# Altium project UltraZohm_Analog_ADS5272.PrjPcb (part 2 of 2)

## Sheet Opamps.SchDoc
size A4; Author: Thomas Kreppel; CompanyName: Universidad de Santiago de Chile; Address1: Avenida Ecuador Nº 3519; Address2: Estación Central, Santiago; Address3: Chile; DocumentNumber: 5; Revision: 3v01; SheetNumber: 5; SheetTotal: 10
Used 2 times, as channels OpAmps, OpAmps. Parts and nets are listed once, with the designators drawn on the sheet.
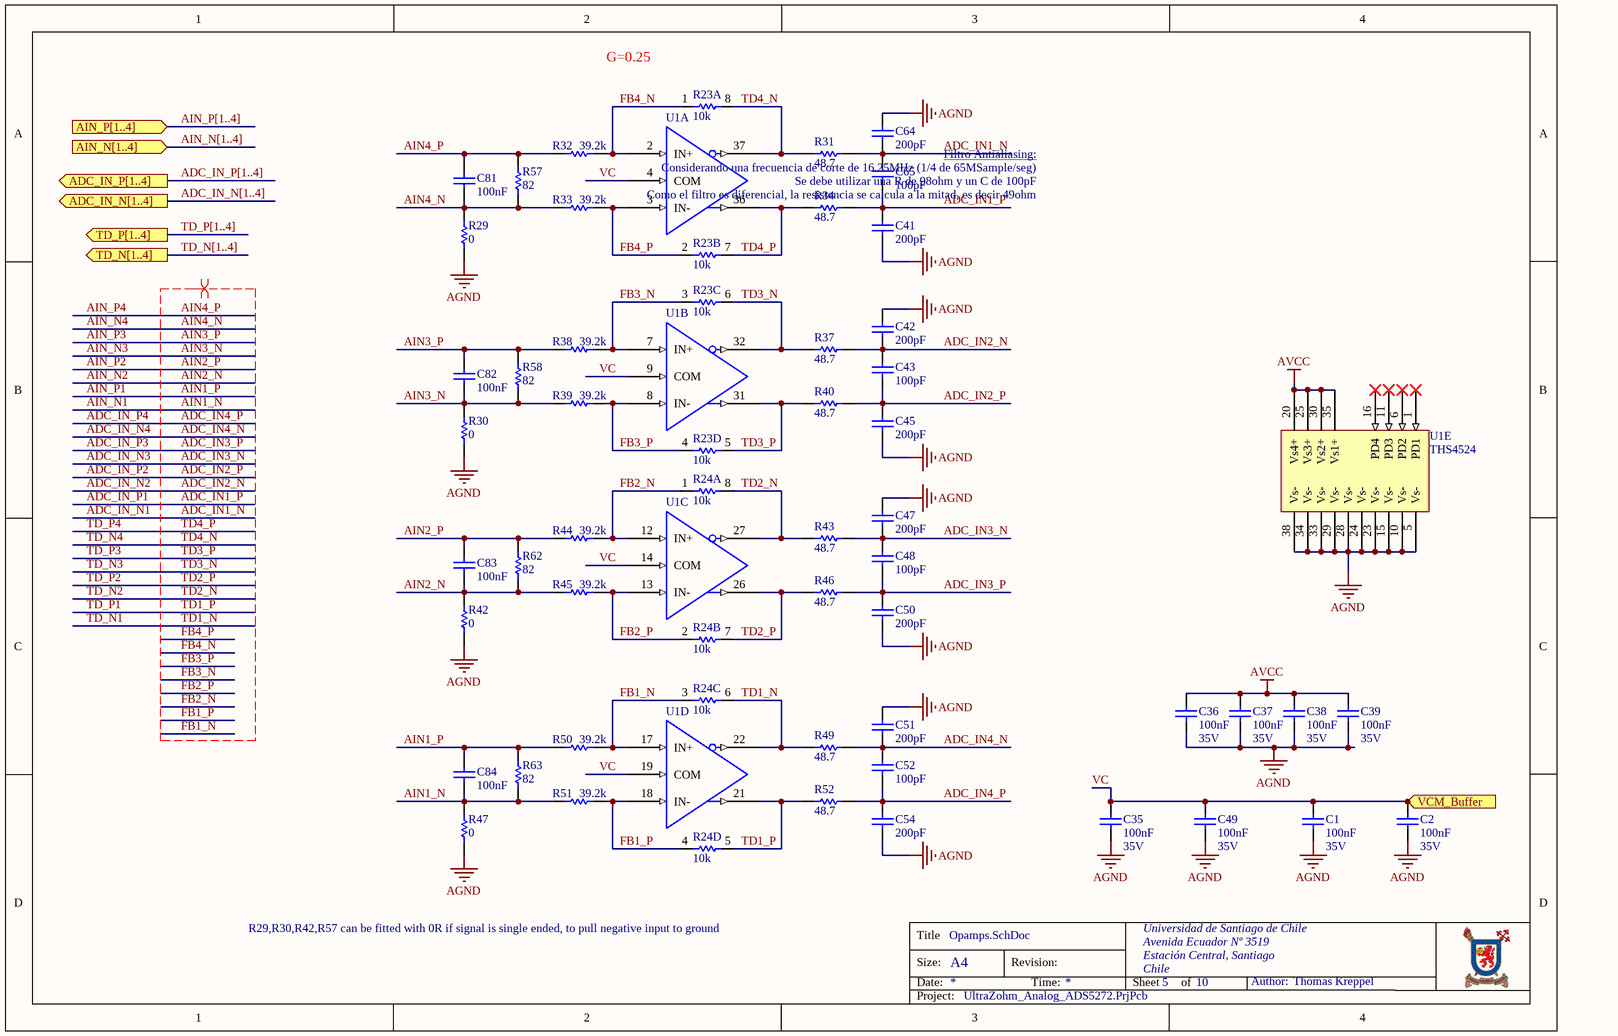
[diagram p9: Opamps.SchDoc]

### Parts
C1  100nF  Voltage: 35V  [CAP_0603]
C2  100nF  Voltage: 35V  [CAP_0603]
C35  100nF  Voltage: 35V  [CAP_0603]
C36  100nF  Voltage: 35V  [CAP_0603]
C37  100nF  Voltage: 35V  [CAP_0603]
C38  100nF  Voltage: 35V  [CAP_0603]
C39  100nF  Voltage: 35V  [CAP_0603]
C41  200pF  [CAP_0603]
C42  200pF  [CAP_0603]
C43  100pF  [CAP_0603]
C45  200pF  [CAP_0603]
C47  200pF  [CAP_0603]
C48  100pF  [CAP_0603]
C49  100nF  Voltage: 35V  [CAP_0603]
C50  200pF  [CAP_0603]
C51  200pF  [CAP_0603]
C52  100pF  [CAP_0603]
C54  200pF  [CAP_0603]
C64  200pF  [CAP_0603]
C65  100pF  [CAP_0603]
C81  100nF  [RES_1206]
C82  100nF  [RES_1206]
C83  100nF  [RES_1206]
C84  100nF  [RES_1206]
R23  10k  [CAC-80P320X160-8N]  (parts A,B,C,D of 4)
R24  10k  [CAC-80P320X160-8N]  (parts A,B,C,D of 4)
R29  0  [RES_0603]
R30  0  [RES_0603]
R31  48.7  [RES_0603]
R32  39.2k  [RES_0603]
R33  39.2k  [RES_0603]
R34  48.7  [RES_0603]
R37  48.7  [RES_0603]
R38  39.2k  [RES_0603]
R39  39.2k  [RES_0603]
R40  48.7  [RES_0603]
R42  0  [RES_0603]
R43  48.7  [RES_0603]
R44  39.2k  [RES_0603]
R45  39.2k  [RES_0603]
R46  48.7  [RES_0603]
R47  0  [RES_0603]
R49  48.7  [RES_0603]
R50  39.2k  [RES_0603]
R51  39.2k  [RES_0603]
R52  48.7  [RES_0603]
R57  82  [RES_1206]
R58  82  [RES_1206]
R62  82  [RES_1206]
R63  82  [RES_1206]
U1  THS4524  [THS4524 Footprint]  (value not drawn)  (parts A,B,C,D,E of 5)

### Ports
ADC_IN_N[1..4] (out), ADC_IN_P[1..4] (out), AIN_N[1..4] (in), AIN_P[1..4] (in), TD_N[1..4] (out), TD_P[1..4] (out), VCM_Buffer (in)

### Nets
AGND: C1.1 C2.1 C35.1 C36.2 C37.2 C38.2 C39.2 C41.2 C42.1 C45.2 C47.1 C49.1 C50.2 C51.1 C54.2 C64.1 R29.2 R30.2 R42.2 R47.2 U1.5(Vs-) U1.10(Vs-) U1.15(Vs-) U1.23(Vs-) U1.24(Vs-) U1.28(Vs-) U1.29(Vs-) U1.33(Vs-) U1.34(Vs-) U1.38(Vs-)
AVCC: C36.1 C37.1 C38.1 C39.1 U1.20(Vs4+) U1.25(Vs3+) U1.30(Vs2+) U1.35(Vs1+)
ADC_IN1_N: C64.2 C65.1 R31.1  [also labelled ADC_IN_N1]
ADC_IN1_P: C41.1 C65.2 R34.1  [also labelled ADC_IN_P1]
ADC_IN2_N: C42.2 C43.1 R37.1  [also labelled ADC_IN_N2]
ADC_IN2_P: C43.2 C45.1 R40.1  [also labelled ADC_IN_P2]
ADC_IN3_N: C47.2 C48.1 R43.1  [also labelled ADC_IN_N3]
ADC_IN3_P: C48.2 C50.1 R46.1  [also labelled ADC_IN_P3]
ADC_IN4_N: C51.2 C52.1 R49.1  [also labelled ADC_IN_N4]
ADC_IN4_P: C52.2 C54.1 R52.1  [also labelled ADC_IN_P4]
AIN1_N: C84.2 R47.1 R51.2 R63.2  [also labelled AIN_N1]
AIN1_P: C84.1 R50.2 R63.1  [also labelled AIN_P1]
AIN2_N: C83.2 R42.1 R45.2 R62.2  [also labelled AIN_N2]
AIN2_P: C83.1 R44.2 R62.1  [also labelled AIN_P2]
AIN3_N: C82.2 R30.1 R39.2 R58.2  [also labelled AIN_N3]
AIN3_P: C82.1 R38.2 R58.1  [also labelled AIN_P3]
AIN4_N: C81.2 R29.1 R33.2 R57.2  [also labelled AIN_N4]
AIN4_P: C81.1 R32.2 R57.1  [also labelled AIN_P4]
FB1_N: R24.3 R50.1 U1.17(IN+)
FB1_P: R24.4 R51.1 U1.18(IN-)
FB2_N: R24.1 R44.1 U1.12(IN+)
FB2_P: R24.2 R45.1 U1.13(IN-)
FB3_N: R23.3 R38.1 U1.7(IN+)
FB3_P: R23.4 R39.1 U1.8(IN-)
FB4_N: R23.1 R32.1 U1.2(IN+)
FB4_P: R23.2 R33.1 U1.3(IN-)
TD1_N: R24.6 R49.2 U1.22(OUT-)  [also labelled TD_N1]
TD1_P: R24.5 R52.2 U1.21(OUT+)  [also labelled TD_P1]
TD2_N: R24.8 R43.2 U1.27(OUT-)  [also labelled TD_N2]
TD2_P: R24.7 R46.2 U1.26(OUT+)  [also labelled TD_P2]
TD3_N: R23.6 R37.2 U1.32(OUT-)  [also labelled TD_N3]
TD3_P: R23.5 R40.2 U1.31(OUT+)  [also labelled TD_P3]
TD4_N: R23.8 R31.2 U1.37(OUT-)  [also labelled TD_N4]
TD4_P: R23.7 R34.2 U1.36(OUT+)  [also labelled TD_P4]
VC: C1.2 C2.2 C35.2 C49.2 U1.4(COM) U1.9(COM) U1.14(COM) U1.19(COM) ; port VCM_Buffer

Not connected (* = marked no-connect by the designer): U1 1(PD1)* 6(PD2)* 11(PD3)* 16(PD4)*

### Channels
OpAmps: designators end in A; ports VCM_Buffer=VC
OpAmps: designators end in B; ports VCM_Buffer=VC

### Buses and harness runs
bus ADC_IN_N[1..4] = port ADC_IN_N[1..4]
bus ADC_IN_P[1..4] = port ADC_IN_P[1..4]
bus AIN_N[1..4] = port AIN_N[1..4]
bus AIN_P[1..4] = port AIN_P[1..4]
bus TD_N[1..4] = port TD_N[1..4]
bus TD_P[1..4] = port TD_P[1..4]

### Layout directives
differential pair: ADC_IN1_N, ADC_IN1_P, ADC_IN2_N, ADC_IN2_P, ADC_IN3_N, ADC_IN3_P, ADC_IN4_N, ADC_IN4_P, AIN1_N, AIN1_P, AIN2_N, AIN2_P, AIN3_N, AIN3_P, AIN4_N, AIN4_P, FB1_N, FB1_P, FB2_N, FB2_P, FB3_N, FB3_P, FB4_N, FB4_P, TD1_N, TD1_P, TD2_N, TD2_P, TD3_N, TD3_P, TD4_N, TD4_P

### Notes on the sheet
- G=0.25
- Considerando una frecuencia de corte de 16.25MHz (1/4 de 65MSample/seg)
- Se debe utilizar una R de 98ohm y un C de 100pF
- Filtro Antialiasing:
- Como el filtro es diferencial, la resistencia se calcula a la mitad, es decir 49ohm
- R29,R30,R42,R57 can be fitted with 0R if signal is single ended, to pull negative input to ground
- Title
- Size:
- Date:
- A4
- Revision:
- Time:
- Sheet
- of
- Author:
- Project:

### Library data of the parts
C1 C2 C35-C39 C49 = Cap_0603: Capacitor; MPN: C0603C104M5RACTU; Rule: PcbType=ProtelPcb; MF: KEMET; Dielectricum: X7R; Tolerance: 10%; Published: 8-Jun-2000; LatestRevisionDate: 17-Jul-2002; LatestRevisionNote: Re-released for DXP Platform.; PackageReference: RAD-0.3; Publisher: Altium Limited; Value: 100nF; Supplier 1: Digikey; Supplier 2: Mouser; Supplier Part Number 1: 399-7845-1-ND; Package: 0603
C41 C42 C45 C47 C50 C51 C54 C64 = Cap_0603: Capacitor; MPN: 0603N201J500CT; Rule: PcbType=ProtelPcb; MF: Walsin; Dielectricum: CG0; Tolerance: 5%; Voltage: 16V; Published: 8-Jun-2000; LatestRevisionDate: 17-Jul-2002; LatestRevisionNote: Re-released for DXP Platform.; PackageReference: RAD-0.3; Publisher: Altium Limited; Value: 200pF; Supplier 1: Digikey; Supplier 2: Mouser; Supplier Part Number 1: 1292-1499-1-ND; Package: 0603
C43 C48 C52 C65 = Cap_0603: Capacitor; MPN: 885012006023; Rule: PcbType=ProtelPcb; MF: Würth Elektronik; Dielectricum: CG0; Tolerance: 5%; Voltage: 16V; Published: 8-Jun-2000; LatestRevisionDate: 17-Jul-2002; LatestRevisionNote: Re-released for DXP Platform.; PackageReference: RAD-0.3; Publisher: Altium Limited; Value: 100pF; Supplier 1: Digikey; Supplier 2: Mouser; Supplier Part Number 1: 732-7766-1-ND; Package: 0603
C81-C84 = Cap_1206: Capacitor; Manufacturer Part-Number: C1206C104K3RACTU; Voltage: 25V; MF: KEMET; Dielectricum: X7R; Tolerance: 10%; Value: 100nF; Supplier 2: Mouser; Supplier 1: Digikey; Supplier Part Number 1: 399-8140-1-ND; Package: 1206
R23 R24 = ResArray 1206: Chip Resistor Array 0606, 4xR; Manufacturer: Vishay; Value: 10k; Created: Kreppel_0420; Supplier 1: Digikey; Supplier Part Number 1: 749-1023-1-ND; Supplier 2: Mouser
R29 R30 R42 R47 = Res0603: Manufacturer Part-Number: CRCW06030000Z0EA; Tolerance: 1%; Published: 8-Jun-2000; LatestRevisionDate: 17-Jul-2002; LatestRevisionNote: Re-released for DXP Platform.; PackageReference: AXIAL-0.3; Publisher: Altium Limited; PackageDescription: Axial Device, Thru-Hole; 2 Leads; 0.3 in Pin Spacing; Value: 0; Supplier 1: Digikey; Supplier 2: Mouser; Supplier Part Number 1: 541-0.0GCT-ND; Package: 0603
R31 R34 R37 R40 R43 R46 R49 R52 = Res0603: Manufacturer Part-Number: ERA-3AEB48R7V; Manufacturer 1: Panasonic; Tolerance: 0.1%; Published: 8-Jun-2000; LatestRevisionDate: 17-Jul-2002; LatestRevisionNote: Re-released for DXP Platform.; PackageReference: AXIAL-0.3; Publisher: Altium Limited; PackageDescription: Axial Device, Thru-Hole; 2 Leads; 0.3 in Pin Spacing; Value: 48.7; Supplier 1: Digikey; Supplier 2: Mouser; Supplier Part Number 1: P48.7DBCT-ND; Package: 0603
R32 R33 R38 R39 R44 R45 R50 R51 = Res0603: Manufacturer Part-Number: ERA-3AEB3922V; Tolerance: 0.1%; Published: 8-Jun-2000; LatestRevisionDate: 17-Jul-2002; LatestRevisionNote: Re-released for DXP Platform.; PackageReference: AXIAL-0.3; Publisher: Altium Limited; PackageDescription: Axial Device, Thru-Hole; 2 Leads; 0.3 in Pin Spacing; Value: 39.2k; Supplier 1: Digikey; Supplier 2: Mouser; Supplier Part Number 1: P39.2KDBCT-ND; Package: 0603
R57 R58 R62 R63 = Res Semi: Limiter Resistor; Manufacturer Part-Number: ERA-8AEB820V; Tolerance: 0.1%; Published: 8-Jun-2000; LatestRevisionDate: 17-Jul-2002; LatestRevisionNote: Re-released for DXP Platform.; PackageReference: AXIAL-0.5; Publisher: Altium Limited; PackageDescription: Axial Device, Thru-Hole; 2 Leads; 0.5 in Pin Spacing; Value: 82; Supplier 1: Digikey; Supplier 2: Mouser; Supplier Part Number 1: P82BCCT-ND; Package: 1206
U1 = THS4524_1: Quad Channel fully differential Amplilfier; Manufacturer: Texas Instruments; Created: 20190720_Kreppel; Package: TSSOP-38; Supplier 1: Digikey; Supplier Part Number 1: 296-24315-1-ND; Supplier 2: Mouser; Supplier Part Number 2: 595-THS4524IDBTR

## Nets that join several sheets
AGND: ADC (31 pins), Power supplies (6 pins), Trip1 (9 pins), Trip2 (9 pins), Trip3 (9 pins), Trip4 (9 pins), Digital Trimmers (25 pins), OpAmps (30 pins), OpAmps (30 pins), Trip5 (9 pins), Trip6 (9 pins), Trip7 (9 pins), Trip8 (9 pins)
AVCC: ADC (21 pins), Power supplies (BS2.2), Trip1 (6 pins), Trip2 (6 pins), Trip3 (6 pins), Trip4 (6 pins), Digital Trimmers (21 pins), OpAmps (8 pins), OpAmps (8 pins), Trip5 (6 pins), Trip6 (6 pins), Trip7 (6 pins), Trip8 (6 pins)
DVCC: ADC (C24.1 C25.1 U5.25 U5.35), Power supplies (BS1.1), Interface Connector (R13.2), Digital Trimmers (R1.1 R2.1), CPLD (21 pins), Led (8 pins)
GND: ADC (11 pins), Power supplies (6 pins), Interface Connector (31 pins), Analog Inputs (C79.1 R28.2), CPLD (31 pins)
REF1.65A: Trip1 (R25A.4), Trip2 (R25B.4), Trip3 (R25C.4), Trip4 (R25D.4), Digital Trimmers (C75.1 REF1.1)
REF1.65B: Digital Trimmers (C78.1 REF2.1), Trip5 (R25E.4), Trip6 (R25F.4), Trip7 (R25G.4), Trip8 (R25H.4)
REF3.3A: Trip1 (U4A.12), Trip2 (U4B.12), Trip3 (U4C.12), Trip4 (U4D.12), Digital Trimmers (C74.1 REF1.5)
REF3.3B: Digital Trimmers (C77.1 REF2.5), Trip5 (U4E.12), Trip6 (U4F.12), Trip7 (U4G.12), Trip8 (U4H.12)
VIN: Power supplies (8 pins), Interface Connector (X2.5 X2.6)
ADC_IN1_N: ADC (P10.2 U5.49), OpAmps (C64A.2 C65A.1 R31A.1)
ADC_IN1_N: ADC (P9.2 U5.3), OpAmps (C64B.2 C65B.1 R31B.1)
ADC_IN1_P: ADC (P10.1 U5.48), OpAmps (C41A.1 C65A.2 R34A.1)
ADC_IN1_P: ADC (P9.1 U5.2), OpAmps (C41B.1 C65B.2 R34B.1)
ADC_IN2_N: ADC (P9.4 U5.6), OpAmps (C42B.2 C43B.1 R37B.1)
ADC_IN2_N: ADC (P10.4 U5.52), OpAmps (C42A.2 C43A.1 R37A.1)
ADC_IN2_P: ADC (P9.3 U5.5), OpAmps (C43B.2 C45B.1 R40B.1)
ADC_IN2_P: ADC (P10.3 U5.51), OpAmps (C43A.2 C45A.1 R40A.1)
ADC_IN3_N: ADC (P9.6 U5.10), OpAmps (C47B.2 C48B.1 R43B.1)
ADC_IN3_N: ADC (P10.6 U5.56), OpAmps (C47A.2 C48A.1 R43A.1)
ADC_IN3_P: ADC (P9.5 U5.9), OpAmps (C48B.2 C50B.1 R46B.1)
ADC_IN3_P: ADC (P10.5 U5.55), OpAmps (C48A.2 C50A.1 R46A.1)
ADC_IN4_N: ADC (P9.8 U5.13), OpAmps (C51B.2 C52B.1 R49B.1)
ADC_IN4_N: ADC (P10.8 U5.59), OpAmps (C51A.2 C52A.1 R49A.1)
ADC_IN4_P: ADC (P9.7 U5.12), OpAmps (C52B.2 C54B.1 R52B.1)
ADC_IN4_P: ADC (P10.7 U5.58), OpAmps (C52A.2 C54A.1 R52A.1)
ADC_N1: ADC (P1.2 U5.22), Interface Connector (X2.25)
ADC_N2: ADC (P2.2 U5.24), Interface Connector (X2.20)
ADC_N3: ADC (P3.2 U5.28), Interface Connector (X2.31)
ADC_N4: ADC (P4.2 U5.30), Interface Connector (X2.26)
ADC_N5: ADC (P5.2 U5.32), Interface Connector (X2.37)
ADC_N6: ADC (P6.2 U5.34), Interface Connector (X2.32)
ADC_N7: ADC (P7.2 U5.38), Interface Connector (X2.43)
ADC_N8: ADC (P8.2 U5.40), Interface Connector (X2.38)
ADC_P1: ADC (P1.1 U5.21), Interface Connector (X2.23)
ADC_P2: ADC (P2.1 U5.23), Interface Connector (X2.18)
ADC_P3: ADC (P3.1 U5.27), Interface Connector (X2.29)
ADC_P4: ADC (P4.1 U5.29), Interface Connector (X2.24)
ADC_P5: ADC (P5.1 U5.31), Interface Connector (X2.35)
ADC_P6: ADC (P6.1 U5.33), Interface Connector (X2.30)
ADC_P7: ADC (P7.1 U5.37), Interface Connector (X2.41)
ADC_P8: ADC (P8.1 U5.39), Interface Connector (X2.36)
ADCLK: Principal (TP10.1), ADC (U5.71), Interface Connector (R180.2)
ADCLK_N: Principal (P12.2), ADC (U5.42), Interface Connector (X2.44)
ADCLK_P: Principal (P12.1), ADC (U5.41), Interface Connector (X2.42)
AIN1_N: Analog Inputs (J1.A2 P13.2), OpAmps (C84A.2 R47A.1 R51A.2 R63A.2)
AIN1_N: Analog Inputs (J1.B2 P14.2), OpAmps (C84B.2 R47B.1 R51B.2 R63B.2)
AIN1_P: Analog Inputs (J1.A1 P13.1), OpAmps (C84A.1 R50A.2 R63A.1)
AIN1_P: Analog Inputs (J1.B1 P14.1), OpAmps (C84B.1 R50B.2 R63B.1)
AIN2_N: Analog Inputs (J1.A6 P13.4), OpAmps (C83A.2 R42A.1 R45A.2 R62A.2)
AIN2_N: Analog Inputs (J1.B6 P14.4), OpAmps (C83B.2 R42B.1 R45B.2 R62B.2)
AIN2_P: Analog Inputs (J1.A3 P13.3), OpAmps (C83A.1 R44A.2 R62A.1)
AIN2_P: Analog Inputs (J1.B3 P14.3), OpAmps (C83B.1 R44B.2 R62B.1)
AIN3_N: Analog Inputs (J1.A5 P13.6), OpAmps (C82A.2 R30A.1 R39A.2 R58A.2)
AIN3_N: Analog Inputs (J1.B5 P14.6), OpAmps (C82B.2 R30B.1 R39B.2 R58B.2)
AIN3_P: Analog Inputs (J1.A4 P13.5), OpAmps (C82A.1 R38A.2 R58A.1)
AIN3_P: Analog Inputs (J1.B4 P14.5), OpAmps (C82B.1 R38B.2 R58B.1)
AIN4_N: Analog Inputs (J1.A8 P13.8), OpAmps (C81A.2 R29A.1 R33A.2 R57A.2)
AIN4_N: Analog Inputs (J1.B8 P14.8), OpAmps (C81B.2 R29B.1 R33B.2 R57B.2)
AIN4_P: Analog Inputs (J1.A7 P13.7), OpAmps (C81A.1 R32A.2 R57A.1)
AIN4_P: Analog Inputs (J1.B7 P14.7), OpAmps (C81B.1 R32B.2 R57B.1)
Collective_FLT: Interface Connector (X2.78), CPLD (U12.82)
CPLD_RST: Interface Connector (X2.59), CPLD (R48.1)
CS: Principal (TP12.1), ADC (U5.76), CPLD (U12.42)
I2C_shared_SCL: Interface Connector (X2.49), CPLD (R21.2 U12.81)
I2C_shared_SDA: Interface Connector (X2.50), CPLD (R22.2 U12.78)
LCLK_N: Principal (P11.2), ADC (U5.20), Interface Connector (X2.19)
LCLK_P: Principal (P11.1), ADC (U5.19), Interface Connector (X2.17)
LED1: CPLD (U12.91), Led (R4.2)
LED2: CPLD (U12.92), Led (R5.2)
LED3: CPLD (U12.87), Led (R6.2)
LED4: CPLD (U12.89), Led (R7.2)
LED5: CPLD (U12.85), Led (R8.2)
LED6: CPLD (U12.86), Led (R9.2)
LED7: CPLD (U12.83), Led (R10.2)
LED8: CPLD (U12.84), Led (R53.2)
PD: Principal (TP14.1), ADC (U5.16), CPLD (U12.38)
RESET_ADC: Principal (TP15.1), ADC (U5.45), CPLD (U12.77)
SCL_TRIM: Digital Trimmers (POT1.5 POT2.5 R2.2), CPLD (U12.76)
SCLK: Principal (TP13.1), ADC (U5.78), CPLD (U12.40)
SDA: Principal (TP11.1), ADC (U5.77), CPLD (U12.41)
SDA_TRIM: Digital Trimmers (POT1.6 POT2.6 R1.2), CPLD (U12.75)
TD1_N: Trip1 (R25A.2), OpAmps (R24B.6 R49B.2 U1B.22)
TD1_N: OpAmps (R24A.6 R49A.2 U1A.22), Trip5 (R25E.2)
TD1_P: Trip1 (R25A.3), OpAmps (R24B.5 R52B.2 U1B.21)
TD1_P: OpAmps (R24A.5 R52A.2 U1A.21), Trip5 (R25E.3)
TD2_N: Trip2 (R25B.2), OpAmps (R24B.8 R43B.2 U1B.27)
TD2_N: OpAmps (R24A.8 R43A.2 U1A.27), Trip6 (R25F.2)
TD2_P: Trip2 (R25B.3), OpAmps (R24B.7 R46B.2 U1B.26)
TD2_P: OpAmps (R24A.7 R46A.2 U1A.26), Trip6 (R25F.3)
TD3_N: Trip3 (R25C.2), OpAmps (R23B.6 R37B.2 U1B.32)
TD3_N: OpAmps (R23A.6 R37A.2 U1A.32), Trip7 (R25G.2)
TD3_P: Trip3 (R25C.3), OpAmps (R23B.5 R40B.2 U1B.31)
TD3_P: OpAmps (R23A.5 R40A.2 U1A.31), Trip7 (R25G.3)
TD4_N: Trip4 (R25D.2), OpAmps (R23B.8 R31B.2 U1B.37)
TD4_N: OpAmps (R23A.8 R31A.2 U1A.37), Trip8 (R25H.2)
TD4_P: Trip4 (R25D.3), OpAmps (R23B.7 R34B.2 U1B.36)
TD4_P: OpAmps (R23A.7 R34A.2 U1A.36), Trip8 (R25H.3)
TRIMMER_Center: Trip1 (C85A.1 DebugA.4 U4A.10), Digital Trimmers (POT1.20)
TRIMMER_Center: Trip2 (C85B.1 DebugB.4 U4B.10), Digital Trimmers (POT1.11)
TRIMMER_Center: Trip3 (C85C.1 DebugC.4 U4C.10), Digital Trimmers (POT1.8)
TRIMMER_Center: Trip4 (C85D.1 DebugD.4 U4D.10), Digital Trimmers (POT1.3)
TRIMMER_Center: Digital Trimmers (POT2.8), Trip7 (C85G.1 DebugG.4 U4G.10)
TRIMMER_Center: Digital Trimmers (POT2.3), Trip8 (C85H.1 DebugH.4 U4H.10)
TRIMMER_Center: Digital Trimmers (POT2.20), Trip5 (C85E.1 DebugE.4 U4E.10)
TRIMMER_Center: Digital Trimmers (POT2.11), Trip6 (C85F.1 DebugF.4 U4F.10)
TRIP: Trip1 (DebugA.1 U6A.4), CPLD (U12.29)
TRIP: Trip2 (DebugB.1 U6B.4), CPLD (U12.28)
TRIP: Trip3 (DebugC.1 U6C.4), CPLD (U12.27)
TRIP: Trip4 (DebugD.1 U6D.4), CPLD (U12.26)
TRIP: CPLD (U12.48), Trip8 (DebugH.1 U6H.4)
TRIP: CPLD (U12.49), Trip7 (DebugG.1 U6G.4)
TRIP: CPLD (U12.50), Trip6 (DebugF.1 U6F.4)
TRIP: CPLD (U12.74), Trip5 (DebugE.1 U6E.4)
VC: ADC (U11.2 U11.6), OpAmps (8 pins), OpAmps (8 pins)

## Assembly variants
SMD_Assembly: not fitted DebugA DebugB DebugC DebugD DebugE DebugF DebugG DebugH P1 P2 P3 P4 P5 P6 P7 P8 P9 P10 P11 P12 P13 P14 R13 R15 R29A R29B R30A R30B R42A R42B R47A R47B R180 TP1 TP2 TP3 TP4 TP5 TP10 TP11 TP12 TP13 TP14 TP15 X3